# Altium schematic sheet TPS5313.SchDoc
size Letter
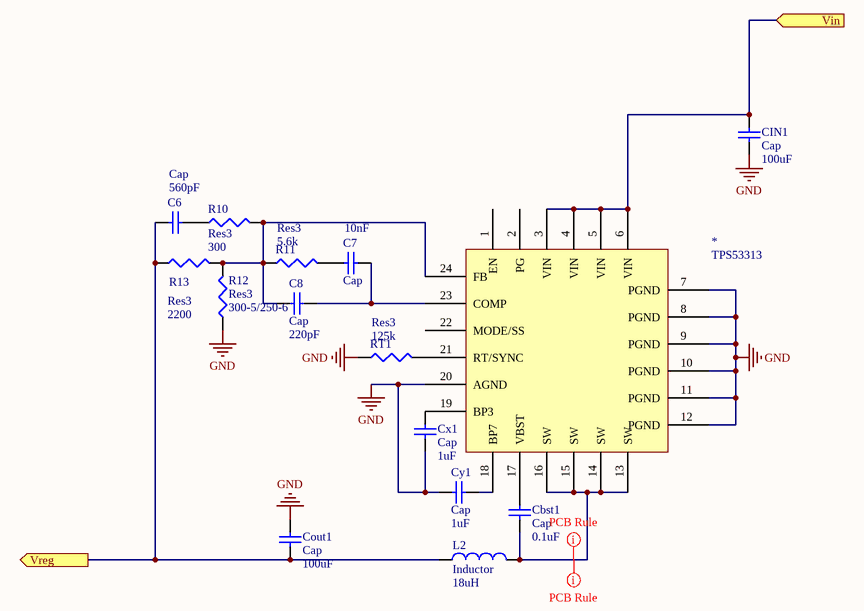
[diagram p0: TPS5313.SchDoc]

## Parts
*  TPS53313  [RGE24_2P45X2P45]
C6  Cap  value 560pF  [C0805]
C7  Cap  value 10nF  [C0805]
C8  Cap  value 220pF  [C0805]
Cbst1  Cap  value 0.1uF  [C0805]
CIN1  Cap  value 100uF  [C0805]
Cout1  Cap  value 100uF  [C0805]
Cx1  Cap  value 1uF  [C0805]
Cy1  Cap  value 1uF  [C0805]
L2  Inductor  value 18uH  [6-0805_L]
R10  Res3  value 300  [6-0805_M]
R11  Res3  value 5.6k  [6-0805_M]
R12  Res3  value 300-5/250-6  [6-0805_M]
R13  Res3  value 2200  [6-0805_M]
RT1  Res3  value 125k  [6-0805_M]

## Ports
Vin (in), Vreg (out)

## Nets
GND: *.7(PGND) *.8(PGND) *.9(PGND) *.10(PGND) *.11(PGND) *.12(PGND) *.20(AGND) CIN1.2 Cout1.2 Cx1.1 Cy1.2 R12.1 RT1.1
Vin: *.3(VIN) *.4(VIN) *.5(VIN) *.6(VIN) CIN1.1 ; port Vin
Vreg: C6.1 Cout1.1 L2.1 R13.1 ; port Vreg
Net*_13: *.13(SW) *.14(SW) *.15(SW) *.16(SW) Cbst1.1 L2.2
Net*_17: *.17(VBST) Cbst1.2
Net*_18: *.18(BP7) Cy1.1
Net*_19: *.19(BP3) Cx1.2
Net*_21: *.21(RT/SYNC) RT1.2
Net*_23: *.23(COMP) C7.2 C8.2
Net*_24: *.24(FB) C8.1 R10.2 R11.1 R12.2 R13.2
NetC6_2: C6.2 R10.1
NetC7_1: C7.1 R11.2

Not connected (* = marked no-connect by the designer): * 1(EN) 2(PG) 22(MODE/SS)

## Layout directives
rule Width Constraint [Pref Width = 40mil    Min Width = 40mil    Max Width = 40mil]: Net*_13
rule Undefined; rule Clearance Constraint [Clearance = 30mil]: Net*_13

## Library data of the parts
C6-C8 Cbst1 CIN1 Cout1 Cx1 Cy1 = Cap: Capacitor; Published: 8-Jun-2000; LatestRevisionDate: 17-Jul-2002; LatestRevisionNote: Re-released for DXP Platform.; PackageReference: RAD-0.3; Publisher: Altium Limited; PackageDescription: Radial Cap, Thru-Hole; 2 Leads; 0.3 in Pin Spacing
L2 = Inductor: Code_IEC: 1005; Published: 8-Jun-2000; LatestRevisionDate: 29-May-2009; LatestRevisionNote: IPC-7351 Footprint Added.; PackageReference: 0402-A; Publisher: Altium Limited; PackageDescription: Chip Inductor; Code_JEITA: 0402
R10-R13 RT1 = Res3: Resistor; Published: 8-Jun-2000; LatestRevisionDate: 29-May-2009; LatestRevisionNote: IPC-7351 Footprint Added.; PackageReference: J1-0603; Publisher: Altium Limited; PackageDescription: Chip Resistor